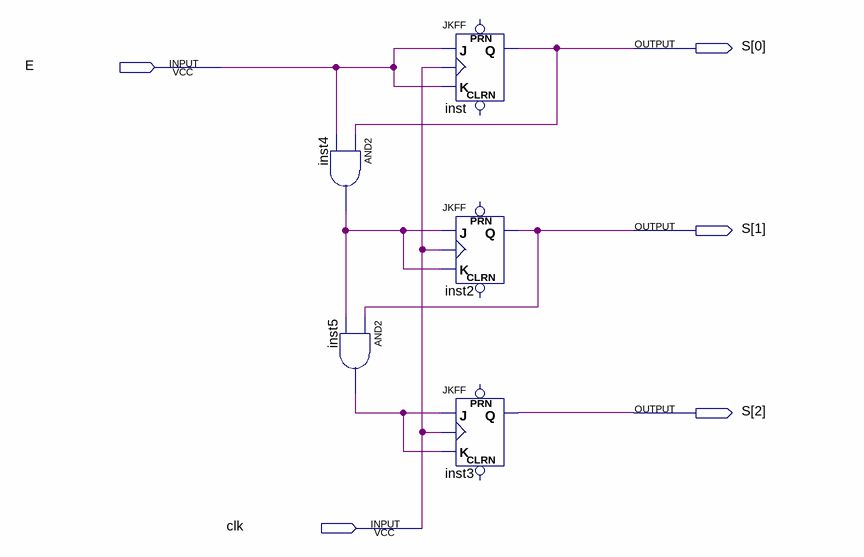
[diagram p0: schematic sheet]
// Quartus schematic HW07_1_jk.bdf as structural Verilog: 5 symbols, 5 pins
module HW07_1_jk (
  input  E,
  input  clk,
  output [2:0] S
);

  wire inst4_out, inst5_out;

  and inst4 (inst4_out, S[0], E);
  and inst5 (inst5_out, S[1], inst4_out);
  JKFF inst (.K(E), .J(E), .CLK(clk), .Q(S[0]));  // open: PRN, CLRN
  JKFF inst2 (.K(inst4_out), .J(inst4_out), .CLK(clk), .Q(S[1]));  // open: PRN, CLRN
  JKFF inst3 (.K(inst5_out), .J(inst5_out), .CLK(clk), .Q(S[2]));  // open: PRN, CLRN
endmodule
